# Altium schematic sheet Power.SchDoc: Title
size A4; Date: *******; ApprovedBy: *******; CheckedBy: None; Author: *******; CompanyName: *******; DrawnBy: Name; Engineer: *******; Organization: *******; Address1: *******; Address2: *******; Address3: *******; Address4: *******; DocumentNumber: 2; Revision: *******; SheetNumber: 2; SheetTotal: 11; CurrentTime: *******; CurrentDate: *******; Time: *******; DocumentFullPathAndName: *******; DocumentName: *******; ModifiedDate: *******; ImagePath: *******; ProjectName: *******; Application_BuildNumber: *******
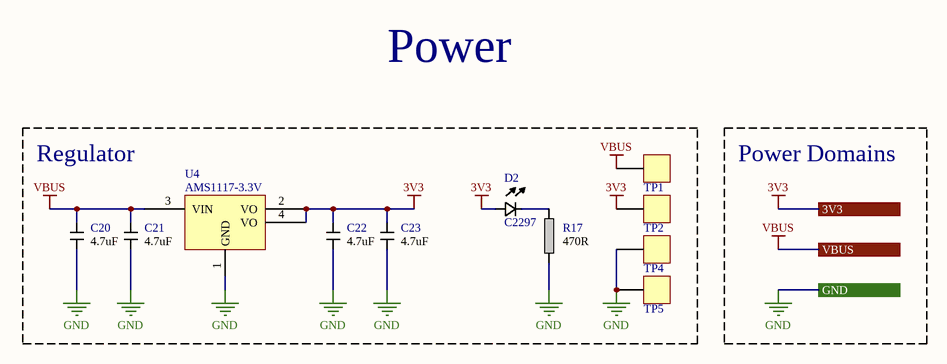
[diagram p0: Power.SchDoc]

## Parts
C20  value 4.7uF  [0805]  (hidden comment: CAP)
C21  value 4.7uF  [0805]  (hidden comment: CAP)
C22  value 4.7uF  [0805]  (hidden comment: CAP)
C23  value 4.7uF  [0805]  (hidden comment: CAP)
D2  Manufacturer Part Number: C2297  [0805]  (hidden comment: LED)
R17  value 470R  [0805]  (hidden comment: RES)
TP1  5V  [5015]  (value not drawn)
TP2  3V3  [5015]  (value not drawn)
TP4  GND  [5015]  (value not drawn)
TP5  GND  [5015]  (value not drawn)
U4  AMS1117-3.3V  [SOT-223]

## Blocks framed on the sheet
Regulator: C20-C23 D2 R17 TP1 TP2 TP4 TP5 U4

## Ports
3V3 (see Lens-Maker[2A], A4988[3B], ESP32_Block[3C], ESP32_Module[3B], GPIO_Header[3B], I2C_Header[3B], SPI_Header[3B], Stepper_Driver[3A]), GND (see Lens-Maker[1B], A4988[3B], ESP32_Block[3D], ESP32_Module[3B], GPIO_Header[3B], I2C_Header[3B], Mechanical_Holes[3B], SPI_Header[3B], Stepper_Driver[3B], USB_Connector[3B]), VBUS (see Lens-Maker[1A], ESP32_Block[3C], ESP32_Module[4B], USB_Connector[3B])

## Nets
3V3: C22.1 C23.1 D2.1 TP2.1 U4.2(VO) U4.4(VO) ; port 3V3
GND: C20.2 C21.2 C22.2 C23.2 R17.2 TP4.1 TP5.1 U4.1(GND) ; port GND
VBUS: C20.1 C21.1 TP1.1 U4.3(VIN) ; port VBUS
NetD2_2: D2.2 R17.1

## Notes on the sheet
- Power
- Power Domains
- Title:
- Size:
- Date:
- Drawn By:
- Page Contents:
- A4
- Checked By:
- Revision:
- Sheet
- of

## Library data of the parts
C20-C23 = CAP: 35V 4.7uF X7R ±10% 0805  Multilayer Ceramic Capacitors MLCC - SMD/SMT ROHS; Manufacturer: Samwha Capacitor; Manufacturer Part Number: CS2012X7R475K350NRE; Supplier: JLCPCB; Supplier Part Number: C560882
D2 = LED: 0805 Light Emitting Diodes (LED) ROHS; Manufacturer: Hubei KENTO Elec; Supplier: JLCPCB; Supplier Part Number: C2297
R17 = RES: 125mW Thick Film Resistors ±1% 470Ω 0805  Chip Resistor - Surface Mount ROHS; Manufacturer: UNI-ROYAL(Uniroyal Elec); Manufacturer Part Number: 0805W8F4700T5E; Supplier: JLCPCB; Supplier Part Number: C17710
TP1 TP2 TP4 TP5 = TESTPOINT_5015: Thimble/Copper Rod/Test Ring ROHS; Manufacturer: Ronghe; Manufacturer Part Number: RH-5015; Supplier: JLCPCB; Supplier Part Number: C5199798
U4 = AMS1117-3.3V: IC-1117 V.reg. 1A 3V3 SOT223 SMD Ams; Manufacturer: Shenzhen Fuman Elec; Supplier: JLCPCB; Supplier Part Number: C173386; Manufacturer Part Number: AMS1117-3.3V